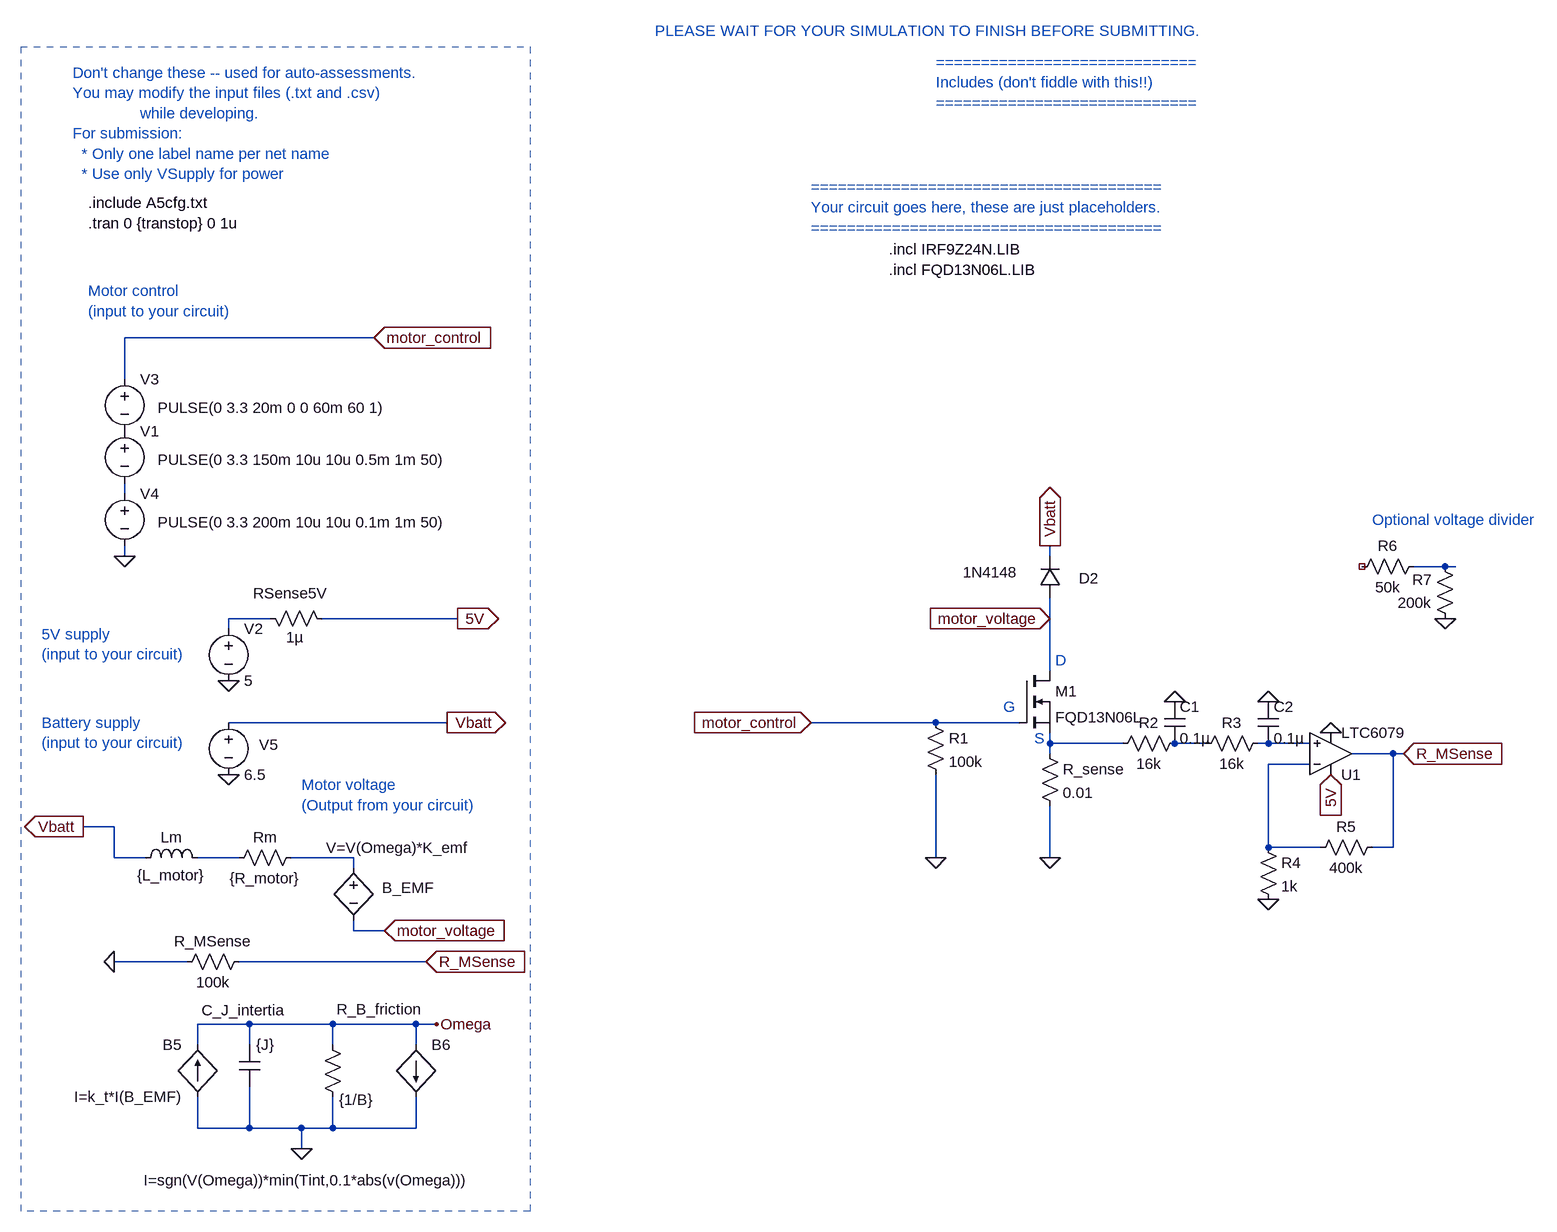
[diagram p0: schematic E344_23782684_A5.asc]
E344_23782684_A5.asc, the LTspice schematic file:
Version 4
SHEET 1 1824 2192
WIRE -1824 -976 -2208 -976
WIRE -2208 -912 -2208 -976
WIRE -2208 -736 -2208 -752
WIRE -2208 -640 -2208 -656
WIRE -784 -640 -784 -656
WIRE -176 -624 -224 -624
WIRE -160 -624 -176 -624
WIRE -1984 -544 -2048 -544
WIRE -1696 -544 -1904 -544
WIRE -784 -544 -784 -576
WIRE -2048 -528 -2048 -544
WIRE -784 -464 -784 -544
WIRE -1712 -384 -2048 -384
WIRE -960 -384 -1152 -384
WIRE -832 -384 -960 -384
WIRE -784 -352 -784 -368
WIRE -672 -352 -784 -352
WIRE -544 -352 -592 -352
WIRE -448 -352 -464 -352
WIRE -384 -352 -448 -352
WIRE -784 -336 -784 -352
WIRE -256 -336 -320 -336
WIRE -240 -336 -256 -336
WIRE -384 -320 -448 -320
WIRE -2224 -224 -2272 -224
WIRE -448 -192 -448 -320
WIRE -368 -192 -448 -192
WIRE -256 -192 -256 -336
WIRE -256 -192 -288 -192
WIRE -2224 -176 -2224 -224
WIRE -2176 -176 -2224 -176
WIRE -2032 -176 -2096 -176
WIRE -1856 -176 -1952 -176
WIRE -960 -176 -960 -304
WIRE -784 -176 -784 -256
WIRE -1856 -160 -1856 -176
WIRE -1856 -64 -1856 -80
WIRE -1808 -64 -1856 -64
WIRE -2112 -16 -2224 -16
WIRE -1744 -16 -2032 -16
WIRE -2016 80 -2096 80
WIRE -1888 80 -2016 80
WIRE -1760 80 -1888 80
WIRE -1728 80 -1760 80
WIRE -2096 112 -2096 80
WIRE -2016 112 -2016 80
WIRE -1888 112 -1888 80
WIRE -1760 112 -1760 80
WIRE -2096 240 -2096 192
WIRE -2016 240 -2016 176
WIRE -2016 240 -2096 240
WIRE -1936 240 -2016 240
WIRE -1888 240 -1888 192
WIRE -1888 240 -1936 240
WIRE -1760 240 -1760 192
WIRE -1760 240 -1888 240
WIRE -1936 272 -1936 240
FLAG -1696 -544 5V
IOPIN -1696 -544 Out
FLAG -2048 -448 0
FLAG -784 -176 0
FLAG -2208 -640 0
FLAG -1824 -976 motor_control
IOPIN -1824 -976 In
FLAG -1152 -384 motor_control
IOPIN -1152 -384 In
FLAG -784 -544 motor_voltage
IOPIN -784 -544 In
FLAG -2048 -304 0
FLAG -1712 -384 Vbatt
IOPIN -1712 -384 Out
FLAG -1808 -64 motor_voltage
IOPIN -1808 -64 In
FLAG -2272 -224 Vbatt
IOPIN -2272 -224 Out
FLAG -1728 80 Omega
FLAG -1936 272 0
FLAG -784 -656 Vbatt
IOPIN -784 -656 Out
FLAG -1744 -16 R_MSense
IOPIN -1744 -16 In
FLAG -2224 -16 0
FLAG -240 -336 R_MSense
IOPIN -240 -336 In
FLAG -352 -304 5V
IOPIN -352 -304 In
FLAG -352 -368 0
FLAG -960 -176 0
FLAG -592 -416 0
FLAG -448 -416 0
FLAG -448 -112 0
FLAG -176 -544 0
SYMBOL voltage -2048 -544 R0
WINDOW 123 0 0 Left 0
WINDOW 39 0 0 Left 0
SYMATTR InstName V2
SYMATTR Value 5
SYMBOL res -2000 -560 M90
WINDOW 0 -7 47 VBottom 2
WINDOW 3 29 54 VTop 2
SYMATTR InstName RSense5V
SYMATTR Value 1µ
SYMBOL diode -768 -576 R180
WINDOW 0 -59 30 Left 2
WINDOW 3 65 39 Left 2
SYMATTR InstName D2
SYMATTR Value 1N4148
SYMBOL voltage -2208 -928 R0
WINDOW 123 0 0 Left 0
WINDOW 39 0 0 Left 0
WINDOW 3 51 60 Left 2
SYMATTR Value PULSE(0 3.3 20m 0 0 60m 60 1)
SYMATTR InstName V3
SYMBOL voltage -2048 -400 R0
WINDOW 123 0 0 Left 0
WINDOW 39 0 0 Left 0
WINDOW 0 47 50 Left 2
SYMATTR InstName V5
SYMATTR Value 6.5
SYMBOL res -2048 -160 R270
WINDOW 3 0 56 VBottom 2
WINDOW 0 32 56 VTop 2
SYMATTR Value {R_motor}
SYMATTR InstName Rm
SYMBOL ind -2192 -160 R270
WINDOW 0 32 56 VTop 2
WINDOW 3 5 56 VBottom 2
SYMATTR InstName Lm
SYMATTR Value {L_motor}
SYMBOL bv -1856 -176 R0
WINDOW 3 -42 -15 Left 2
WINDOW 0 44 46 Left 2
SYMATTR Value V=V(Omega)*K_emf
SYMATTR InstName B_EMF
SYMBOL bi -2096 192 R180
WINDOW 0 24 80 Left 2
WINDOW 3 24 0 Left 2
SYMATTR InstName B5
SYMATTR Value I=k_t*I(B_EMF)
SYMBOL bi -1760 112 R0
WINDOW 3 -419 208 Left 2
SYMATTR Value I=sgn(V(Omega))*min(Tint,0.1*abs(v(Omega)))
SYMATTR InstName B6
SYMBOL cap -2032 112 R0
WINDOW 0 -58 -53 Left 2
WINDOW 3 26 0 Left 2
SYMATTR InstName C_J_intertia
SYMATTR Value {J}
SYMBOL res -1904 96 R0
WINDOW 0 22 -39 Left 2
WINDOW 3 26 100 Left 2
SYMATTR InstName R_B_friction
SYMATTR Value {1/B}
SYMBOL voltage -2208 -848 R0
WINDOW 123 0 0 Left 0
WINDOW 39 0 0 Left 0
WINDOW 3 51 60 Left 2
SYMATTR Value PULSE(0 3.3 150m 10u 10u 0.5m 1m 50)
SYMATTR InstName V1
SYMBOL voltage -2208 -752 R0
WINDOW 123 0 0 Left 0
WINDOW 39 0 0 Left 0
WINDOW 3 51 60 Left 2
SYMATTR Value PULSE(0 3.3 200m 10u 10u 0.1m 1m 50)
SYMATTR InstName V4
SYMBOL res -800 -352 R0
SYMATTR InstName R_sense
SYMATTR Value 0.01
SYMBOL res -2016 -32 R90
WINDOW 0 0 56 VBottom 2
WINDOW 3 32 56 VTop 2
SYMATTR InstName R_MSense
SYMATTR Value 100k
SYMBOL Opamps\\LTC6079 -352 -336 M180
SYMATTR InstName U1
SYMBOL nmos -832 -464 R0
SYMATTR InstName M1
SYMATTR Value FQD13N06L
SYMBOL res -976 -400 R0
SYMATTR InstName R1
SYMATTR Value 100k
SYMBOL res -576 -368 R90
WINDOW 0 0 56 VBottom 2
WINDOW 3 32 56 VTop 2
SYMATTR InstName R2
SYMATTR Value 16k
SYMBOL res -448 -368 R90
WINDOW 0 0 56 VBottom 2
WINDOW 3 32 56 VTop 2
SYMATTR InstName R3
SYMATTR Value 16k
SYMBOL cap -608 -416 R0
SYMATTR InstName C1
SYMATTR Value 0.1µ
SYMBOL cap -464 -416 R0
SYMATTR InstName C2
SYMATTR Value 0.1µ
SYMBOL res -464 -208 R0
SYMATTR InstName R4
SYMATTR Value 1k
SYMBOL res -272 -208 R90
WINDOW 0 0 56 VBottom 2
WINDOW 3 32 56 VTop 2
SYMATTR InstName R5
SYMATTR Value 400k
SYMBOL res -208 -640 R90
WINDOW 0 0 56 VBottom 2
WINDOW 3 32 56 VTop 2
SYMATTR InstName R6
SYMATTR Value 50k
SYMBOL res -160 -528 R180
WINDOW 0 36 76 Left 2
WINDOW 3 36 40 Left 2
SYMATTR InstName R7
SYMATTR Value 200k
TEXT -2288 -1384 Left 2 ;Don't change these -- used for auto-assessments.\nYou may modify the input files (.txt and .csv) \n               while developing.\nFor submission: \n  * Only one label name per net name\n  * Use only VSupply for power
TEXT -960 -1400 Left 2 ;=============================\nIncludes (don't fiddle with this!!)\n=============================
TEXT -1152 -1208 Left 2 ;=======================================\nYour circuit goes here, these are just placeholders.\n=======================================
TEXT -1392 -1448 Left 2 ;PLEASE WAIT FOR YOUR SIMULATION TO FINISH BEFORE SUBMITTING.
TEXT -2264 -1152 Left 2 !.tran 0 {transtop} 0 1u
TEXT -2264 -1184 Left 2 !.include A5cfg.txt
TEXT -2264 -1048 Left 2 ;Motor control\n(input to your circuit)
TEXT -2336 -520 Left 2 ;5V supply \n(input to your circuit)
TEXT -2336 -384 Left 2 ;Battery supply \n(input to your circuit)
TEXT -1936 -288 Left 2 ;Motor voltage\n(Output from your circuit)
TEXT -1032 -1112 Left 2 !.incl IRF9Z24N.LIB\n.incl FQD13N06L.LIB
TEXT -856 -408 Left 2 ;G
TEXT -776 -480 Left 2 ;D
TEXT -808 -360 Left 2 ;S
TEXT -288 -696 Left 2 ;Optional voltage divider
LINE Normal -1584 -1424 -1584 368 2
LINE Normal -2368 -1424 -1584 -1424 2
LINE Normal -1584 368 -2368 368 2
LINE Normal -2368 -1424 -2368 368 2

The netlist it stands for:
* E344_23782684_A5.asc
V2 N003 0 5
RSense5V N003 5V 1µ
D2 motor_voltage Vbatt 1N4148
V3 motor_control P001 PULSE(0 3.3 20m 0 0 60m 60 1)
V5 Vbatt 0 6.5
Rm N008 N009 {R_motor}
Lm Vbatt N008 {L_motor}
B_EMF N009 motor_voltage V=V(Omega)*K_emf
B5 0 Omega I=k_t*I(B_EMF)
B6 Omega 0 I=sgn(V(Omega))*min(Tint,0.1*abs(v(Omega)))
C_J_intertia Omega 0 {J}
R_B_friction Omega 0 {1/B}
V1 P001 N001 PULSE(0 3.3 150m 10u 10u 0.5m 1m 50)
V4 N001 0 PULSE(0 3.3 200m 10u 10u 0.1m 1m 50)
R_sense N004 0 0.01
R_MSense R_MSense 0 100k
XU1 N006 N007 5V 0 R_MSense LTC6078  ; LTC6079, pins In+ In- V+ V- OUT
M1 motor_voltage motor_control N004 N004 FQD13N06L
R1 motor_control 0 100k
R2 N005 N004 16k
R3 N006 N005 16k
C1 0 N005 0.1µ
C2 0 N006 0.1µ
R4 N007 0 1k
R5 R_MSense N007 400k
R6 N002 NC_01 50k
R7 0 N002 200k
.model D D
.lib standard.dio
.model NMOS NMOS
.model PMOS PMOS
.lib standard.mos
* Don't change these -- used for auto-assessments.
* You may modify the input files (.txt and .csv)
*                while developing.
* For submission:
*   * Only one label name per net name
*   * Use only VSupply for power
* =============================
* Includes (don't fiddle with this!!)
* =============================
* =======================================
* Your circuit goes here, these are just placeholders.
* =======================================
* PLEASE WAIT FOR YOUR SIMULATION TO FINISH BEFORE SUBMITTING.
.tran 0 {transtop} 0 1u
.include A5cfg.txt
* Motor control
* (input to your circuit)
* 5V supply
* (input to your circuit)
* Battery supply
* (input to your circuit)
* Motor voltage
* (Output from your circuit)
.incl IRF9Z24N.LIB
.incl FQD13N06L.LIB
* G
* D
* S
* Optional voltage divider
.lib LTC5.lib
.backanno
.end